# EAGLE design v1 (EAGLE 8.7.0)
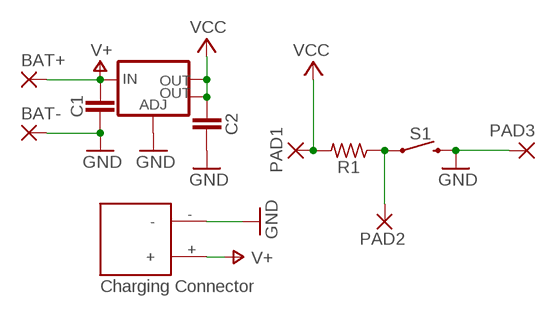
[diagram p0: schematic, sheet 1]

## Parts
BAT+  SMD2  [SMD1,27-2,54]
BAT-  SMD2  [SMD1,27-2,54]
C1  C-EUC0402  [C0402]
C2  C-EUC0402  [C0402]
PAD1  SMD2  [SMD1,27-2,54]
PAD2  SMD2  [SMD1,27-2,54]
PAD3  SMD2  [SMD1,27-2,54]
R1  R-US_R0402  [R0402]
S1  MOMENTARY-SWITCH-SPST-PTH-6.0MM  [TACTILE_SWITCH_PTH_6.0MM]
U1  V_REG_LM1117SOT223  [SOT223]
U$1  JST-JST-2  [JST-JST-2]

## Nets
GND: BAT-.1(P) C1.1 C2.1 PAD3.1(P) S1.3 U1.1(ADJ) U$1.-
N$1: PAD2.1(P) R1.1 S1.1
V+: BAT+.1(P) C1.2 U1.3(IN) U$1.+
VCC: C2.2 PAD1.1(P) R1.2 U1.2(OUT) U1.4(OUT)

## Notes on the sheet
- Charging Connector

## Library data of the parts
BAT+ BAT- PAD1-PAD3 = wirepad:SMD2: SMD PAD
C1 C2 = rcl:C-EU: CAPACITOR, European symbol
R1 = rcl:R-US_: RESISTOR, American symbol
S1 = SparkFun-Switches:MOMENTARY-SWITCH-SPST: Momentary Switch (Pushbutton) - SPST Normally-open (NO) SPST momentary switches (buttons, pushbuttons). Variants PTH-12MM - 12mm square, through-hole Momentary Pushbutton Switch - 12mm Square <https://www.sparkfun.com/products/9190> (COM-09190) PTH-6.0MM, PTH-6.0MM-KIT - 6.0mm square, through-hole Mini Pushbutton Switch <https://www.sparkfun.com/products/97> (COM-00097) KIT package intended for soldering kit's - only one side of pads' copper is exposed. PTH-RIGHT-ANGLE-KIT - Right-angle, through-hole Right Angle Tactile Button <https://www.sparkfun.com/products/10791> - Used on SparkFun BigTime Watch Kit <https://www.sparkfun.com/products/11734> SMD-12MM - 12mm square, surface-mount Tactile Button - SMD (12mm) <https://www.sparkfun.com/products/12993> (COM-12993) Used on SparkFun PicoBoard <https://www.sparkfun.com/products/11888> SMD-4.5MM - 4.5mm Square Trackball Switch Used on SparkFun Blackberry Trackballer Breakout <https://www.sparkfun.com/products/13169> SMD-4.6MMX2.8MM - 4.60mm x 2.80mm, surface mount Used on SparkFun SAMD21 Mini Breakout <https://www.sparkfun.com/products/13664> SMD-5.2MM, SMD-5.2-REDUNDANT - 5.2mm square, surface-mount Mini Pushbutton Switch - SMD <https://www.sparkfun.com/products/8720> (COM-08720) Used on Arduino Pro Mini <https://www.sparkfun.com/products/11114> REDUNDANT package connects both switch circuits together SMD-6.0X3.5MM - 6.0 x 3.5mm, surface mount Momentary Reset Switch SMD <https://www.sparkfun.com/products/8229> (COM-08229) SMD-6.2MM-TALL - 6.2mm square, surface mount Tactile Button - SMD (6mm) <https://www.sparkfun.com/products/12992> Used on SparkFun Digital Sandbox <https://www.sparkfun.com/products/12651> SMD-RIGHT-ANGLE - Right-angle, surface mount Used on SparkFun Block for Intel® Edison - Arduino <https://www.sparkfun.com/products/13036>; PROD_ID: SWCH-08441; SF_SKU: COM-00097
U1 = SparkFun-PowerIC:V_REG_LM1117: Voltage Regulator LM1117 Standard adjustable voltage regulator but in SMD form. Spark Fun Electronics SKU : COM-00595; PROD_ID: VREG-08170
U$1 = jst-sh:JST-JST-2

## Board
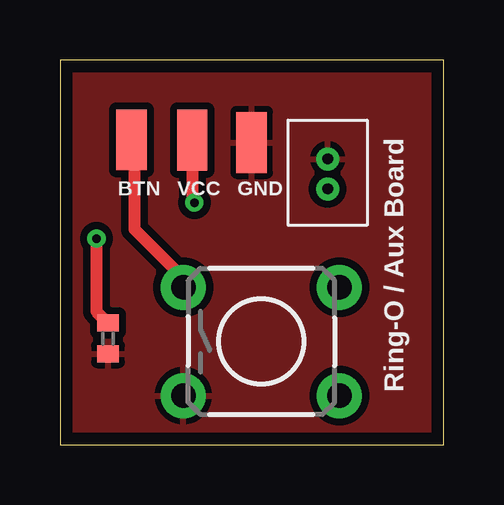
[diagram p1: board, top side]
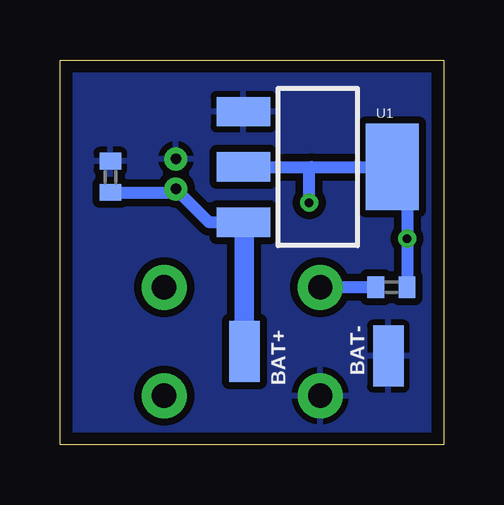
[diagram p2: board, bottom side, seen from below]

Size 15.98 x 16.05 mm. Coordinates in mm from the lower left corner, seen from the top.
Outline: 0,0 15.98,0 15.98,16.05 0,16.05 0,0
Copper layers (1*16): Top 0.035mm / dielectric 1.5mm / Bottom 0.035mm
Design rules "default *": minimum track width 6mil, minimum drill 0.35mm, track to track 6mil, track to pad 6mil, pad to pad 6mil, via to via 6mil, smd to smd 6mil, copper to edge 20mil, drill to drill 6mil, minimum pad ring 10mil, minimum via ring 8mil, stop-mask expansion 4mil, vias tented up to drill 0.35mm, thermal gap 10mil

### Footprints (pad centres in the part's own frame; a part is rotated, then mirrored left to right if it is on the bottom)
SMD1,27-2,54 = smd 1.27 x 2.54: 1 0,0
C0402 = smd 0.7 x 0.9: 1 -0.65,0; 2 0.65,0
R0402 = smd 0.7 x 0.9: 1 -0.65,0; 2 0.65,0
TACTILE_SWITCH_PTH_6.0MM = drill 1.016 pad 1.88: 1 -3.251,2.261; 2 3.251,2.261; 3 -3.251,-2.261; 4 3.251,-2.261
SOT223 = smd 1.219 x 2.235: 1 -2.311,-3.099; 2 0,-3.099; 3 2.311,-3.099 | smd 3.6 x 2.2: 4 0,3.099
JST-JST-2 = drill 0.45: + 1.525,1.65; - 2.775,1.65

### Placement (x,y rotation side)
BAT+  8.3,3.9 180 bottom
BAT-  2.3,3.7 0 bottom
C1  13.88,11.18 270 bottom
C2  2,4.44 90 top
PAD1  5.51,12.7 0 top
PAD2  2.97,12.72 0 top
PAD3  7.98,12.61 0 top
R1  2.17,6.57 0 bottom
S1  8.39,4.31 0 top
U1  5.24,11.59 270 bottom
U$1  12.8,9.15 90 top

### Tracks (layer width: path | path; a pad name or v marks a point on that pad's centre or on a via)
GND
  pour Top (isolate 0.305): 0,16 16,16 16,0 0,0
  pour Bottom (isolate 0.305): 0,16 16,16 16,0 2,-1 0,0
N$1
  Top 0.508: PAD2.1 3.1,12.49 3.1,9 5.14,6.96 S1.1
  Bottom 0.508: R1.1 S1.1
V+
  Bottom 0.508: U1.3 9.75,9.28 U$1.+ 11.29,10.53 C1.2
  Bottom 0.813: BAT+.1 8.3,9.24 U1.3
VCC  (via drill 0.35)
  Top 0.508: v1.52,8.6 1.52,5.57 C2.2 | PAD1.1 5.51,10.19 v5.6,10.1
  Bottom 0.508: U1.2 5.5,11.59 | 5.5,11.59 U1.4 1.52,10.97 v1.52,8.6 R1.2 | v5.6,10.1 5.6,11.49 5.5,11.59

### Text on the board
tNames: BTN VCC GND | Ring-O / Aux Board